# Altium project AMDC.PrjPCB (part 4 of 4)
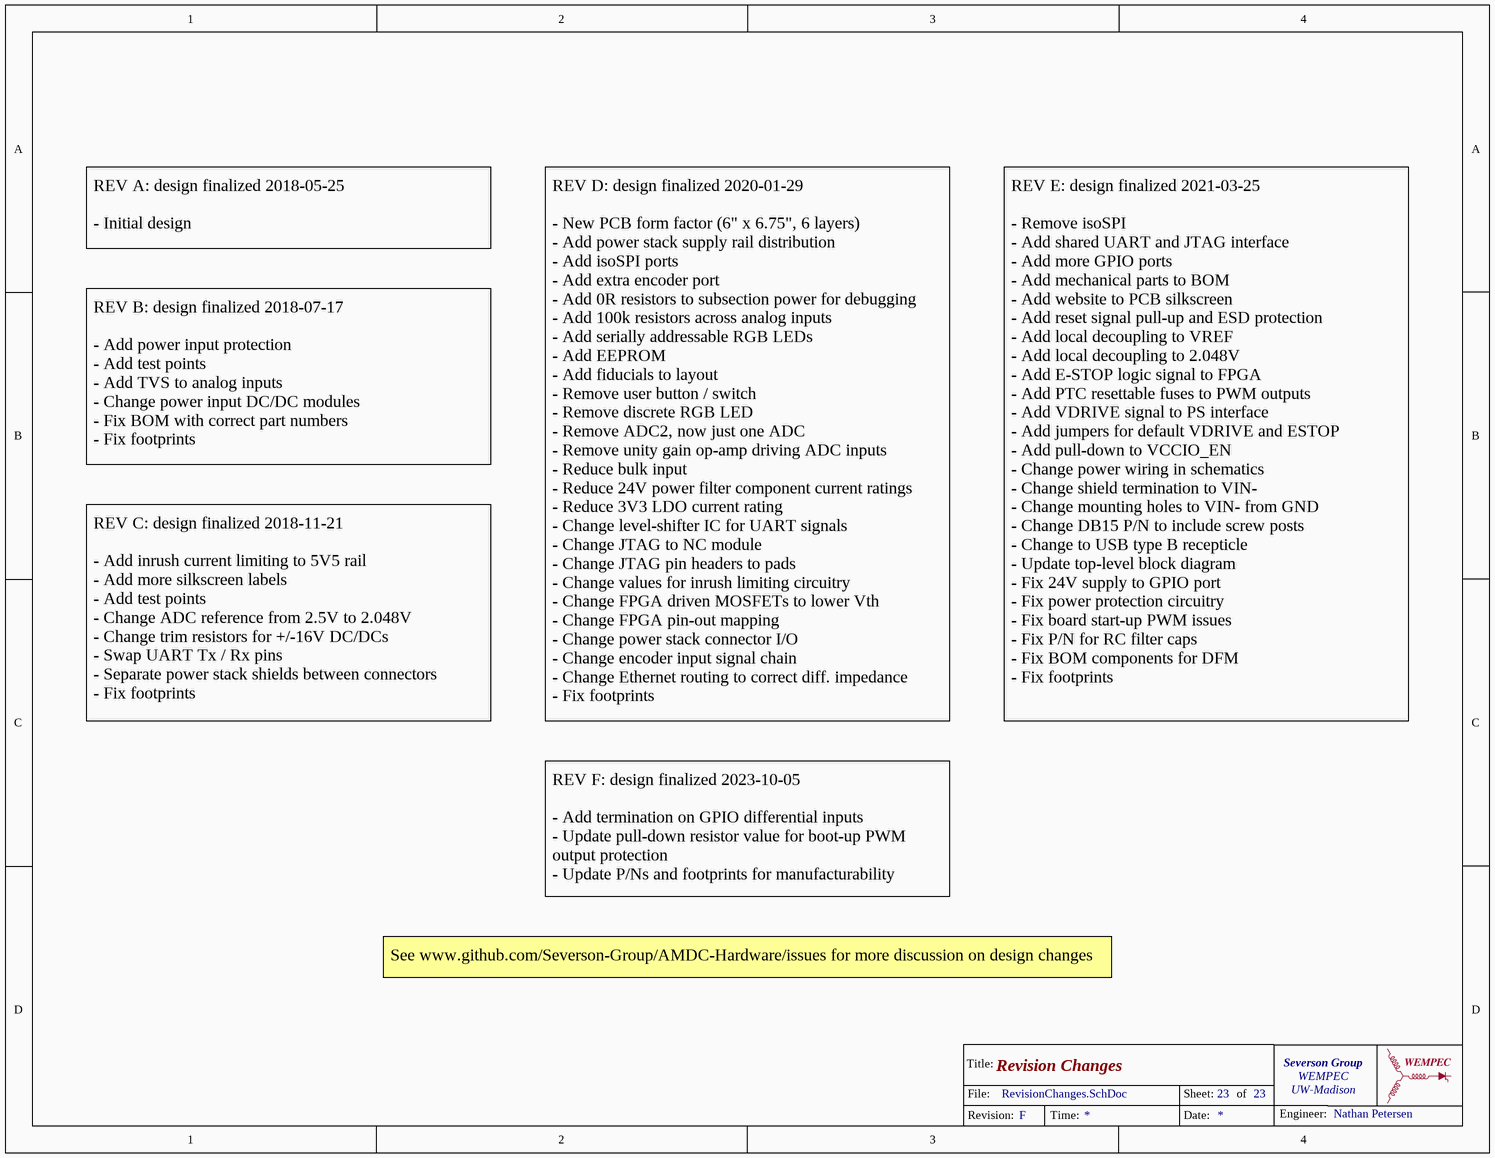
[diagram p23: RevisionChanges.SchDoc]

## Nets that join several sheets
1.8V: PicoZed (5 pins), DriveInterface (C110.2 U42.1 U42.5), InverterTranslation (JP4.3 JP5.3 JP6.3 JP7.3), U_PicoZed/U_DriveInterface/U_InverterTranslation/U_LVHV8ChanTranslation1 (C74A.2 U24A.1 U24A.2), U_PicoZed/U_DriveInterface/U_InverterTranslation/U_LVHV8ChanTranslation2 (C74B.2 U24B.1 U24B.2), U_PicoZed/U_DriveInterface/U_InverterTranslation/U_LVHV8ChanTranslation3 (C74C.2 U24C.1 U24C.2), U_PicoZed/U_DriveInterface/U_InverterTranslation/U_LVHV8ChanTranslation4 (C74D.2 U24D.1 U24D.2), U_PicoZed/U_DriveInterface/U_InverterTranslation/U_LVHV8ChanTranslation5 (C74E.2 U24E.1 U24E.2), U_PicoZed/U_DriveInterface/U_InverterTranslation/U_LVHV8ChanTranslation6 (C74F.2 U24F.1 U24F.2), U_PicoZed/U_DriveInterface/U_InverterTranslation/U_TranslationStsA (C94A.1 U31A.1), U_PicoZed/U_DriveInterface/U_InverterTranslation/U_TranslationStsB (C94B.1 U31B.1), U_PicoZed/U_DriveInterface/U_InverterTranslation/U_TranslationStsC (C94C.1 U31C.1), U_PicoZed/U_DriveInterface/U_InverterTranslation/U_TranslationStsD (C94D.1 U31D.1), AnalogADCs (R81.1), Encoder (C30.1 U5.23 U5.24), BoardIO (6 pins), Power (C43.1 R73.1 U12.1 U12.5), JTAG_UART (C116.2 M1.2 R38.1), U_PicoZed/U_GPIO/U_TranslationGPIO_IN_A (C94E.1 U31E.1), U_PicoZed/U_GPIO/U_TranslationGPIO_OUT_A (C94F.1 U31F.1 U31F.2), U_PicoZed/U_GPIO/U_TranslationGPIO_IN_B (C94G.1 U31G.1), U_PicoZed/U_GPIO/U_TranslationGPIO_OUT_B (C94H.1 U31H.1 U31H.2)
3.3V: DriveInterface (JP1.1), GbEthernet (CON7.14 CON7.16), BoardIO (R2.1 R3.1), Power (R70.1), JTAG_UART (C115.2 M1.8 M1.15)
5.5V: Power (13 pins), Power_InrushLimit (U30.7 U30.8)
5V: DriveInterface (5 pins), U_PicoZed/U_DriveInterface/U_InverterTranslation/U_LVHV8ChanTranslation1 (C71A.1 U24A.23 U24A.24), U_PicoZed/U_DriveInterface/U_InverterTranslation/U_LVHV8ChanTranslation2 (C71B.1 U24B.23 U24B.24), U_PicoZed/U_DriveInterface/U_InverterTranslation/U_LVHV8ChanTranslation3 (C71C.1 U24C.23 U24C.24), U_PicoZed/U_DriveInterface/U_InverterTranslation/U_LVHV8ChanTranslation4 (C71D.1 U24D.23 U24D.24), U_PicoZed/U_DriveInterface/U_InverterTranslation/U_LVHV8ChanTranslation5 (C71E.1 U24E.23 U24E.24), U_PicoZed/U_DriveInterface/U_InverterTranslation/U_LVHV8ChanTranslation6 (C71F.1 U24F.23 U24F.24), AnalogInterface (C98.2 U2.1), AnalogADCs (R80.1), Encoder (9 pins), BoardIO (21 pins), Power (C45.1 R72.1 U12.6), JTAG_UART (U45.5), GPIO (16 pins), U_PicoZed/U_GPIO/U_TranslationGPIO_IN_A (C93E.1 U31E.23 U31E.24), U_PicoZed/U_GPIO/U_TranslationGPIO_OUT_A (C93F.1 U31F.23 U31F.24), U_PicoZed/U_GPIO/U_TranslationGPIO_IN_B (C93G.1 U31G.23 U31G.24), U_PicoZed/U_GPIO/U_TranslationGPIO_OUT_B (C93H.1 U31H.23 U31H.24)
24V: Power (C96.2 C97.2 U7.6), GPIO (CON9.6A CON9.6B CON11.6A CON11.6B)
+15V: AnalogConnectors (CON1.3A CON1.3B CON1.3C CON1.3D), AnalogConditioning (R75.1 R78.1), Power (R71.1)
-15V: AnalogConnectors (CON1.5A CON1.5B CON1.5C CON1.5D), AnalogConditioning (R76.1 R79.1), Power (R74.1)
GND: PicoZed (84 pins), DriveInterface (6 pins), U_PicoZed/U_DriveInterface/U_InverterConnectors/InverterConnector1AB (CON10A.15A CON10A.15B R95A.1 R96A.1), U_PicoZed/U_DriveInterface/U_InverterConnectors/InverterConnector2AB (CON10B.15A CON10B.15B R95B.1 R96B.1), U_PicoZed/U_DriveInterface/U_InverterConnectors/InverterConnector3AB (CON10C.15A CON10C.15B R95C.1 R96C.1), U_PicoZed/U_DriveInterface/U_InverterConnectors/InverterConnector4AB (CON10D.15A CON10D.15B R95D.1 R96D.1), InverterTranslation (JP4.1 JP5.1 JP6.1 JP7.1), U_PicoZed/U_DriveInterface/U_InverterTranslation/U_LVHV8ChanTranslation1 (14 pins), U_PicoZed/U_DriveInterface/U_InverterTranslation/U_LVHV8ChanTranslation2 (14 pins), U_PicoZed/U_DriveInterface/U_InverterTranslation/U_LVHV8ChanTranslation3 (14 pins), U_PicoZed/U_DriveInterface/U_InverterTranslation/U_LVHV8ChanTranslation4 (14 pins), U_PicoZed/U_DriveInterface/U_InverterTranslation/U_LVHV8ChanTranslation5 (14 pins), U_PicoZed/U_DriveInterface/U_InverterTranslation/U_LVHV8ChanTranslation6 (14 pins), U_PicoZed/U_DriveInterface/U_InverterTranslation/U_TranslationStsA (6 pins), U_PicoZed/U_DriveInterface/U_InverterTranslation/U_TranslationStsB (6 pins), U_PicoZed/U_DriveInterface/U_InverterTranslation/U_TranslationStsC (6 pins), U_PicoZed/U_DriveInterface/U_InverterTranslation/U_TranslationStsD (6 pins), AnalogInterface (C98.1 C117.1 U2.3), AnalogADCs (37 pins), AnalogConnectors (24 pins), U_PicoZed/U_AnalogInterface/U_AnalogConditioning/AnalogSigCond_A (10 pins), U_PicoZed/U_AnalogInterface/U_AnalogConditioning/AnalogSigCond_B (10 pins), GbEthernet (C31.1 C32.1 C33.1 C34.1), Encoder (20 pins), BoardIO (25 pins), Power (42 pins), Power_InrushLimit (C91.1 C92.1 U30.5 U30.9), JTAG_UART (8 pins), GPIO (28 pins), U_PicoZed/U_GPIO/U_TranslationGPIO_IN_A (9 pins), U_PicoZed/U_GPIO/U_TranslationGPIO_OUT_A (8 pins), U_PicoZed/U_GPIO/U_TranslationGPIO_IN_B (9 pins), U_PicoZed/U_GPIO/U_TranslationGPIO_OUT_B (8 pins)
GND_IN: U_PicoZed/U_DriveInterface/U_InverterConnectors/InverterConnector1AB (R17A.2), U_PicoZed/U_DriveInterface/U_InverterConnectors/InverterConnector2AB (R17B.2), U_PicoZed/U_DriveInterface/U_InverterConnectors/InverterConnector3AB (R17C.2), U_PicoZed/U_DriveInterface/U_InverterConnectors/InverterConnector4AB (R17D.2), AnalogConnectors (R1.2), GbEthernet (R10.2), Encoder (R9.1), BoardIO (CON3.2), Power (C37.1 L1.2), Power_Protection (6 pins), JTAG_UART (R18.2), GPIO (R19.2 R20.2), BackPage (13 pins)
VCCO: PicoZed (13 pins), Power (R65.2)
VDRIVE: U_PicoZed/U_DriveInterface/U_InverterConnectors/InverterConnector1AB (R93A.2 R94A.2), U_PicoZed/U_DriveInterface/U_InverterConnectors/InverterConnector2AB (R93B.2 R94B.2), U_PicoZed/U_DriveInterface/U_InverterConnectors/InverterConnector3AB (R93C.2 R94C.2), U_PicoZed/U_DriveInterface/U_InverterConnectors/InverterConnector4AB (R93D.2 R94D.2), U_PicoZed/U_DriveInterface/U_InverterTranslation/U_LVHV8ChanTranslation1 (8 pins), U_PicoZed/U_DriveInterface/U_InverterTranslation/U_LVHV8ChanTranslation2 (8 pins), U_PicoZed/U_DriveInterface/U_InverterTranslation/U_LVHV8ChanTranslation3 (8 pins), U_PicoZed/U_DriveInterface/U_InverterTranslation/U_LVHV8ChanTranslation4 (8 pins), U_PicoZed/U_DriveInterface/U_InverterTranslation/U_LVHV8ChanTranslation5 (8 pins), U_PicoZed/U_DriveInterface/U_InverterTranslation/U_LVHV8ChanTranslation6 (8 pins), BoardIO (JP12.2)
VIN_HDR: PicoZed (12 pins), BoardIO (R4.1), Power (R64.1)
5.5VICL: Power (JP10.1), Power_InrushLimit (5 pins)
+15V: AnalogConditioning (R75.2), U_PicoZed/U_AnalogInterface/U_AnalogConditioning/AnalogSigCond_A (C82A.2 C85A.2 U28A.11 U29A.11)
+15V: AnalogConditioning (R78.2), U_PicoZed/U_AnalogInterface/U_AnalogConditioning/AnalogSigCond_B (C82B.2 C85B.2 U28B.11 U29B.11)
-15V: AnalogConditioning (R76.2), U_PicoZed/U_AnalogInterface/U_AnalogConditioning/AnalogSigCond_A (C84A.1 C88A.1 U28A.4 U29A.4)
-15V: AnalogConditioning (R79.2), U_PicoZed/U_AnalogInterface/U_AnalogConditioning/AnalogSigCond_B (C84B.1 C88B.1 U28B.4 U29B.4)
ADC_CLKOUT: PicoZed (SOM1.JX1-23), AnalogADCs (TP3.1 U1.33)
ADC_CNV: PicoZed (SOM1.JX1-9), AnalogADCs (TP1.1 U1.24)
ADC_IN1: AnalogADCs (U1.20), U_PicoZed/U_AnalogInterface/U_AnalogConditioning/AnalogSigCond_A (C79A.1 R63A.1)
ADC_IN2: AnalogADCs (U1.17), U_PicoZed/U_AnalogInterface/U_AnalogConditioning/AnalogSigCond_A (C86A.1 R62A.1)
ADC_IN3: AnalogADCs (U1.14), U_PicoZed/U_AnalogInterface/U_AnalogConditioning/AnalogSigCond_B (C77B.1 R61B.1)
ADC_IN4: AnalogADCs (U1.11), U_PicoZed/U_AnalogInterface/U_AnalogConditioning/AnalogSigCond_B (C81B.1 R60B.1)
ADC_IN5: AnalogADCs (U1.5), U_PicoZed/U_AnalogInterface/U_AnalogConditioning/AnalogSigCond_B (C86B.1 R62B.1)
ADC_IN6: AnalogADCs (U1.2), U_PicoZed/U_AnalogInterface/U_AnalogConditioning/AnalogSigCond_B (C79B.1 R63B.1)
ADC_IN7: AnalogADCs (U1.51), U_PicoZed/U_AnalogInterface/U_AnalogConditioning/AnalogSigCond_A (C81A.1 R60A.1)
ADC_IN8: AnalogADCs (U1.48), U_PicoZed/U_AnalogInterface/U_AnalogConditioning/AnalogSigCond_A (C77A.1 R61A.1)
ADC_SCK: PicoZed (SOM1.JX1-37), AnalogADCs (TP2.1 U1.41)
ADC_SDO1: PicoZed (SOM1.JX1-11), AnalogADCs (U1.27)
ADC_SDO2: PicoZed (SOM1.JX1-13), AnalogADCs (U1.28)
ADC_SDO3: PicoZed (SOM1.JX1-17), AnalogADCs (U1.29)
ADC_SDO4: PicoZed (SOM1.JX1-19), AnalogADCs (U1.30)
ADC_SDO5: PicoZed (SOM1.JX1-25), AnalogADCs (U1.35)
ADC_SDO6: PicoZed (SOM1.JX1-29), AnalogADCs (U1.36)
ADC_SDO7: PicoZed (SOM1.JX1-31), AnalogADCs (U1.39)
ADC_SDO8: PicoZed (SOM1.JX1-35), AnalogADCs (U1.40)
ANLG_N1: AnalogConnectors (CON1.2A R84.1 U37.3), U_PicoZed/U_AnalogInterface/U_AnalogConditioning/AnalogSigCond_A (U29A.10)
ANLG_N2: AnalogConnectors (CON1.8A R85.1 U35.2), U_PicoZed/U_AnalogInterface/U_AnalogConditioning/AnalogSigCond_A (U29A.12)
ANLG_N3: AnalogConnectors (CON1.2B R86.1 U36.1), U_PicoZed/U_AnalogInterface/U_AnalogConditioning/AnalogSigCond_B (U28B.10)
ANLG_N4: AnalogConnectors (CON1.8B R87.1 U38.2), U_PicoZed/U_AnalogInterface/U_AnalogConditioning/AnalogSigCond_B (U28B.12)
ANLG_N5: AnalogConnectors (CON1.2C R88.1 U35.4), U_PicoZed/U_AnalogInterface/U_AnalogConditioning/AnalogSigCond_B (U29B.12)
ANLG_N6: AnalogConnectors (CON1.8C R89.1 U37.2), U_PicoZed/U_AnalogInterface/U_AnalogConditioning/AnalogSigCond_B (U29B.10)
ANLG_N7: AnalogConnectors (CON1.2D R90.1 U38.4), U_PicoZed/U_AnalogInterface/U_AnalogConditioning/AnalogSigCond_A (U28A.12)
ANLG_N8: AnalogConnectors (CON1.8D R91.1 U36.3), U_PicoZed/U_AnalogInterface/U_AnalogConditioning/AnalogSigCond_A (U28A.10)
ANLG_P1: AnalogConnectors (CON1.1A R84.2 U37.4), U_PicoZed/U_AnalogInterface/U_AnalogConditioning/AnalogSigCond_A (U29A.8)
ANLG_P2: AnalogConnectors (CON1.7A R85.2 U35.1), U_PicoZed/U_AnalogInterface/U_AnalogConditioning/AnalogSigCond_A (U29A.14)
ANLG_P3: AnalogConnectors (CON1.1B R86.2 U36.4), U_PicoZed/U_AnalogInterface/U_AnalogConditioning/AnalogSigCond_B (U28B.8)
ANLG_P4: AnalogConnectors (CON1.7B R87.2 U38.1), U_PicoZed/U_AnalogInterface/U_AnalogConditioning/AnalogSigCond_B (U28B.14)
ANLG_P5: AnalogConnectors (CON1.1C R88.2 U35.3), U_PicoZed/U_AnalogInterface/U_AnalogConditioning/AnalogSigCond_B (U29B.14)
ANLG_P6: AnalogConnectors (CON1.7C R89.2 U37.1), U_PicoZed/U_AnalogInterface/U_AnalogConditioning/AnalogSigCond_B (U29B.8)
ANLG_P7: AnalogConnectors (CON1.1D R90.2 U38.3), U_PicoZed/U_AnalogInterface/U_AnalogConditioning/AnalogSigCond_A (U28A.14)
ANLG_P8: AnalogConnectors (CON1.7D R91.2 U36.2), U_PicoZed/U_AnalogInterface/U_AnalogConditioning/AnalogSigCond_A (U28A.8)
CARRIER_SRST_N: PicoZed (SOM1.JX1-6), BoardIO (C24.2 R21.2), JTAG_UART (M1.9 R38.2)
DRIVE_EN: DriveInterface (U43.4), U_PicoZed/U_DriveInterface/U_InverterTranslation/U_LVHV8ChanTranslation1 (8 pins), U_PicoZed/U_DriveInterface/U_InverterTranslation/U_LVHV8ChanTranslation2 (8 pins), U_PicoZed/U_DriveInterface/U_InverterTranslation/U_LVHV8ChanTranslation3 (8 pins), U_PicoZed/U_DriveInterface/U_InverterTranslation/U_LVHV8ChanTranslation4 (8 pins), U_PicoZed/U_DriveInterface/U_InverterTranslation/U_LVHV8ChanTranslation5 (8 pins), U_PicoZed/U_DriveInterface/U_InverterTranslation/U_LVHV8ChanTranslation6 (8 pins)
ESTOP_DRIVE_EN: DriveInterface (U43.2), BoardIO (7 pins)
ETH_MD1_N: PicoZed (SOM1.JX3-53), GbEthernet (CON7.10)
ETH_MD1_P: PicoZed (SOM1.JX3-51), GbEthernet (CON7.11)
ETH_MD2_N: PicoZed (SOM1.JX3-54), GbEthernet (CON7.5)
ETH_MD2_P: PicoZed (SOM1.JX3-52), GbEthernet (CON7.4)
ETH_MD3_N: PicoZed (SOM1.JX3-59), GbEthernet (CON7.2)
ETH_MD3_P: PicoZed (SOM1.JX3-57), GbEthernet (CON7.3)
ETH_MD4_N: PicoZed (SOM1.JX3-60), GbEthernet (CON7.9)
ETH_MD4_P: PicoZed (SOM1.JX3-58), GbEthernet (CON7.8)
ETH_PHY_LED0: PicoZed (SOM1.JX3-47), GbEthernet (CON7.13)
ETH_PHY_LED1: PicoZed (SOM1.JX3-48), GbEthernet (CON7.17)
FPGA_DONE: PicoZed (SOM1.JX1-8), BoardIO (R6.2)
GND_IN_PS: U_PicoZed/U_DriveInterface/U_InverterConnectors/InverterConnector1AB (CON10A.14A CON10A.14B), U_PicoZed/U_DriveInterface/U_InverterConnectors/InverterConnector2AB (CON10B.14A CON10B.14B), U_PicoZed/U_DriveInterface/U_InverterConnectors/InverterConnector3AB (CON10C.14A CON10C.14B), U_PicoZed/U_DriveInterface/U_InverterConnectors/InverterConnector4AB (CON10D.14A CON10D.14B), BoardIO (CON5.2)
GPIO1_IN1: GPIO (U22.3), U_PicoZed/U_GPIO/U_TranslationGPIO_IN_A (U31E.21)
GPIO1_IN2: GPIO (U22.5), U_PicoZed/U_GPIO/U_TranslationGPIO_IN_A (U31E.20)
GPIO1_IN3: GPIO (U22.11), U_PicoZed/U_GPIO/U_TranslationGPIO_IN_A (U31E.19)
GPIO1_OUT1: GPIO (U33.1), U_PicoZed/U_GPIO/U_TranslationGPIO_OUT_A (U31F.21)
GPIO1_OUT2: GPIO (U33.7), U_PicoZed/U_GPIO/U_TranslationGPIO_OUT_A (U31F.20)
GPIO1_OUT3: GPIO (U33.9), U_PicoZed/U_GPIO/U_TranslationGPIO_OUT_A (U31F.19)
GPIO2_IN1: GPIO (U22.13), U_PicoZed/U_GPIO/U_TranslationGPIO_IN_A (U31E.18)
GPIO2_IN2: GPIO (U34.3), U_PicoZed/U_GPIO/U_TranslationGPIO_IN_A (U31E.17)
GPIO2_IN3: GPIO (U34.5), U_PicoZed/U_GPIO/U_TranslationGPIO_IN_A (U31E.16)
GPIO2_OUT1: GPIO (U33.15), U_PicoZed/U_GPIO/U_TranslationGPIO_OUT_A (U31F.18)
GPIO2_OUT2: GPIO (U46.1), U_PicoZed/U_GPIO/U_TranslationGPIO_OUT_A (U31F.17)
GPIO2_OUT3: GPIO (U46.7), U_PicoZed/U_GPIO/U_TranslationGPIO_OUT_A (U31F.16)
GPIO3_IN1: GPIO (U34.11), U_PicoZed/U_GPIO/U_TranslationGPIO_IN_B (U31G.21)
GPIO3_IN2: GPIO (U34.13), U_PicoZed/U_GPIO/U_TranslationGPIO_IN_B (U31G.20)
GPIO3_IN3: GPIO (U47.3), U_PicoZed/U_GPIO/U_TranslationGPIO_IN_B (U31G.19)
GPIO3_OUT1: GPIO (U46.9), U_PicoZed/U_GPIO/U_TranslationGPIO_OUT_B (U31H.21)
GPIO3_OUT2: GPIO (U46.15), U_PicoZed/U_GPIO/U_TranslationGPIO_OUT_B (U31H.20)
GPIO3_OUT3: GPIO (U48.1), U_PicoZed/U_GPIO/U_TranslationGPIO_OUT_B (U31H.19)
GPIO4_IN1: GPIO (U47.5), U_PicoZed/U_GPIO/U_TranslationGPIO_IN_B (U31G.18)
GPIO4_IN2: GPIO (U47.11), U_PicoZed/U_GPIO/U_TranslationGPIO_IN_B (U31G.17)
GPIO4_IN3: GPIO (U47.13), U_PicoZed/U_GPIO/U_TranslationGPIO_IN_B (U31G.16)
GPIO4_OUT1: GPIO (U48.7), U_PicoZed/U_GPIO/U_TranslationGPIO_OUT_B (U31H.18)
GPIO4_OUT2: GPIO (U48.9), U_PicoZed/U_GPIO/U_TranslationGPIO_OUT_B (U31H.17)
GPIO4_OUT3: GPIO (U48.15), U_PicoZed/U_GPIO/U_TranslationGPIO_OUT_B (U31H.16)
INV1_PWM1: U_PicoZed/U_DriveInterface/U_InverterConnectors/InverterConnector1AB (RT1A.1), U_PicoZed/U_DriveInterface/U_InverterTranslation/U_LVHV8ChanTranslation5 (U23E.11)
INV1_PWM2: U_PicoZed/U_DriveInterface/U_InverterConnectors/InverterConnector1AB (RT3A.1), U_PicoZed/U_DriveInterface/U_InverterTranslation/U_LVHV8ChanTranslation5 (U23E.12)
INV1_PWM3: U_PicoZed/U_DriveInterface/U_InverterConnectors/InverterConnector1AB (RT5A.1), U_PicoZed/U_DriveInterface/U_InverterTranslation/U_LVHV8ChanTranslation5 (U23E.13)
INV1_PWM4: U_PicoZed/U_DriveInterface/U_InverterConnectors/InverterConnector1AB (RT7A.1), U_PicoZed/U_DriveInterface/U_InverterTranslation/U_LVHV8ChanTranslation5 (U23E.14)
INV1_PWM5: U_PicoZed/U_DriveInterface/U_InverterConnectors/InverterConnector1AB (RT9A.1), U_PicoZed/U_DriveInterface/U_InverterTranslation/U_LVHV8ChanTranslation6 (U25F.11)
INV1_PWM6: U_PicoZed/U_DriveInterface/U_InverterConnectors/InverterConnector1AB (RT11A.1), U_PicoZed/U_DriveInterface/U_InverterTranslation/U_LVHV8ChanTranslation6 (U25F.12)
INV2_PWM1: U_PicoZed/U_DriveInterface/U_InverterConnectors/InverterConnector1AB (RT2A.1), U_PicoZed/U_DriveInterface/U_InverterTranslation/U_LVHV8ChanTranslation6 (U23F.13)
INV2_PWM2: U_PicoZed/U_DriveInterface/U_InverterConnectors/InverterConnector1AB (RT4A.1), U_PicoZed/U_DriveInterface/U_InverterTranslation/U_LVHV8ChanTranslation6 (U23F.12)
INV2_PWM3: U_PicoZed/U_DriveInterface/U_InverterConnectors/InverterConnector1AB (RT6A.1), U_PicoZed/U_DriveInterface/U_InverterTranslation/U_LVHV8ChanTranslation6 (U23F.11)
INV2_PWM4: U_PicoZed/U_DriveInterface/U_InverterConnectors/InverterConnector1AB (RT8A.1), U_PicoZed/U_DriveInterface/U_InverterTranslation/U_LVHV8ChanTranslation6 (U25F.14)
INV2_PWM5: U_PicoZed/U_DriveInterface/U_InverterConnectors/InverterConnector1AB (RT10A.1), U_PicoZed/U_DriveInterface/U_InverterTranslation/U_LVHV8ChanTranslation6 (U25F.13)
INV2_PWM6: U_PicoZed/U_DriveInterface/U_InverterConnectors/InverterConnector1AB (RT12A.1), U_PicoZed/U_DriveInterface/U_InverterTranslation/U_LVHV8ChanTranslation6 (U23F.14)
INV3_PWM1: U_PicoZed/U_DriveInterface/U_InverterConnectors/InverterConnector2AB (RT1B.1), U_PicoZed/U_DriveInterface/U_InverterTranslation/U_LVHV8ChanTranslation4 (U25D.11)
INV3_PWM2: U_PicoZed/U_DriveInterface/U_InverterConnectors/InverterConnector2AB (RT3B.1), U_PicoZed/U_DriveInterface/U_InverterTranslation/U_LVHV8ChanTranslation4 (U25D.12)
INV3_PWM3: U_PicoZed/U_DriveInterface/U_InverterConnectors/InverterConnector2AB (RT5B.1), U_PicoZed/U_DriveInterface/U_InverterTranslation/U_LVHV8ChanTranslation4 (U25D.13)
INV3_PWM4: U_PicoZed/U_DriveInterface/U_InverterConnectors/InverterConnector2AB (RT7B.1), U_PicoZed/U_DriveInterface/U_InverterTranslation/U_LVHV8ChanTranslation4 (U25D.14)
INV3_PWM5: U_PicoZed/U_DriveInterface/U_InverterConnectors/InverterConnector2AB (RT9B.1), U_PicoZed/U_DriveInterface/U_InverterTranslation/U_LVHV8ChanTranslation4 (U23D.11)
INV3_PWM6: U_PicoZed/U_DriveInterface/U_InverterConnectors/InverterConnector2AB (RT11B.1), U_PicoZed/U_DriveInterface/U_InverterTranslation/U_LVHV8ChanTranslation4 (U23D.12)
INV4_PWM1: U_PicoZed/U_DriveInterface/U_InverterConnectors/InverterConnector2AB (RT2B.1), U_PicoZed/U_DriveInterface/U_InverterTranslation/U_LVHV8ChanTranslation5 (U25E.13)
INV4_PWM2: U_PicoZed/U_DriveInterface/U_InverterConnectors/InverterConnector2AB (RT4B.1), U_PicoZed/U_DriveInterface/U_InverterTranslation/U_LVHV8ChanTranslation5 (U25E.12)
INV4_PWM3: U_PicoZed/U_DriveInterface/U_InverterConnectors/InverterConnector2AB (RT6B.1), U_PicoZed/U_DriveInterface/U_InverterTranslation/U_LVHV8ChanTranslation5 (U25E.11)
INV4_PWM4: U_PicoZed/U_DriveInterface/U_InverterConnectors/InverterConnector2AB (RT8B.1), U_PicoZed/U_DriveInterface/U_InverterTranslation/U_LVHV8ChanTranslation4 (U23D.14)
INV4_PWM5: U_PicoZed/U_DriveInterface/U_InverterConnectors/InverterConnector2AB (RT10B.1), U_PicoZed/U_DriveInterface/U_InverterTranslation/U_LVHV8ChanTranslation4 (U23D.13)
INV4_PWM6: U_PicoZed/U_DriveInterface/U_InverterConnectors/InverterConnector2AB (RT12B.1), U_PicoZed/U_DriveInterface/U_InverterTranslation/U_LVHV8ChanTranslation5 (U25E.14)
INV5_PWM1: U_PicoZed/U_DriveInterface/U_InverterConnectors/InverterConnector3AB (RT1C.1), U_PicoZed/U_DriveInterface/U_InverterTranslation/U_LVHV8ChanTranslation2 (U23B.11)
INV5_PWM2: U_PicoZed/U_DriveInterface/U_InverterConnectors/InverterConnector3AB (RT3C.1), U_PicoZed/U_DriveInterface/U_InverterTranslation/U_LVHV8ChanTranslation2 (U23B.12)
INV5_PWM3: U_PicoZed/U_DriveInterface/U_InverterConnectors/InverterConnector3AB (RT5C.1), U_PicoZed/U_DriveInterface/U_InverterTranslation/U_LVHV8ChanTranslation2 (U23B.13)
INV5_PWM4: U_PicoZed/U_DriveInterface/U_InverterConnectors/InverterConnector3AB (RT7C.1), U_PicoZed/U_DriveInterface/U_InverterTranslation/U_LVHV8ChanTranslation2 (U23B.14)
INV5_PWM5: U_PicoZed/U_DriveInterface/U_InverterConnectors/InverterConnector3AB (RT9C.1), U_PicoZed/U_DriveInterface/U_InverterTranslation/U_LVHV8ChanTranslation3 (U25C.11)
INV5_PWM6: U_PicoZed/U_DriveInterface/U_InverterConnectors/InverterConnector3AB (RT11C.1), U_PicoZed/U_DriveInterface/U_InverterTranslation/U_LVHV8ChanTranslation3 (U25C.12)
INV6_PWM1: U_PicoZed/U_DriveInterface/U_InverterConnectors/InverterConnector3AB (RT2C.1), U_PicoZed/U_DriveInterface/U_InverterTranslation/U_LVHV8ChanTranslation3 (U23C.13)
INV6_PWM2: U_PicoZed/U_DriveInterface/U_InverterConnectors/InverterConnector3AB (RT4C.1), U_PicoZed/U_DriveInterface/U_InverterTranslation/U_LVHV8ChanTranslation3 (U23C.12)
INV6_PWM3: U_PicoZed/U_DriveInterface/U_InverterConnectors/InverterConnector3AB (RT6C.1), U_PicoZed/U_DriveInterface/U_InverterTranslation/U_LVHV8ChanTranslation3 (U23C.11)
INV6_PWM4: U_PicoZed/U_DriveInterface/U_InverterConnectors/InverterConnector3AB (RT8C.1), U_PicoZed/U_DriveInterface/U_InverterTranslation/U_LVHV8ChanTranslation3 (U25C.14)
INV6_PWM5: U_PicoZed/U_DriveInterface/U_InverterConnectors/InverterConnector3AB (RT10C.1), U_PicoZed/U_DriveInterface/U_InverterTranslation/U_LVHV8ChanTranslation3 (U25C.13)
INV6_PWM6: U_PicoZed/U_DriveInterface/U_InverterConnectors/InverterConnector3AB (RT12C.1), U_PicoZed/U_DriveInterface/U_InverterTranslation/U_LVHV8ChanTranslation3 (U23C.14)
INV7_PWM1: U_PicoZed/U_DriveInterface/U_InverterConnectors/InverterConnector4AB (RT1D.1), U_PicoZed/U_DriveInterface/U_InverterTranslation/U_LVHV8ChanTranslation1 (U25A.11)
INV7_PWM2: U_PicoZed/U_DriveInterface/U_InverterConnectors/InverterConnector4AB (RT3D.1), U_PicoZed/U_DriveInterface/U_InverterTranslation/U_LVHV8ChanTranslation1 (U25A.12)
INV7_PWM3: U_PicoZed/U_DriveInterface/U_InverterConnectors/InverterConnector4AB (RT5D.1), U_PicoZed/U_DriveInterface/U_InverterTranslation/U_LVHV8ChanTranslation1 (U25A.13)
INV7_PWM4: U_PicoZed/U_DriveInterface/U_InverterConnectors/InverterConnector4AB (RT7D.1), U_PicoZed/U_DriveInterface/U_InverterTranslation/U_LVHV8ChanTranslation1 (U25A.14)
INV7_PWM5: U_PicoZed/U_DriveInterface/U_InverterConnectors/InverterConnector4AB (RT9D.1), U_PicoZed/U_DriveInterface/U_InverterTranslation/U_LVHV8ChanTranslation1 (U23A.11)
INV7_PWM6: U_PicoZed/U_DriveInterface/U_InverterConnectors/InverterConnector4AB (RT11D.1), U_PicoZed/U_DriveInterface/U_InverterTranslation/U_LVHV8ChanTranslation1 (U23A.12)
INV8_PWM1: U_PicoZed/U_DriveInterface/U_InverterConnectors/InverterConnector4AB (RT2D.1), U_PicoZed/U_DriveInterface/U_InverterTranslation/U_LVHV8ChanTranslation2 (U25B.13)
INV8_PWM2: U_PicoZed/U_DriveInterface/U_InverterConnectors/InverterConnector4AB (RT4D.1), U_PicoZed/U_DriveInterface/U_InverterTranslation/U_LVHV8ChanTranslation2 (U25B.12)
INV8_PWM3: U_PicoZed/U_DriveInterface/U_InverterConnectors/InverterConnector4AB (RT6D.1), U_PicoZed/U_DriveInterface/U_InverterTranslation/U_LVHV8ChanTranslation2 (U25B.11)
INV8_PWM4: U_PicoZed/U_DriveInterface/U_InverterConnectors/InverterConnector4AB (RT8D.1), U_PicoZed/U_DriveInterface/U_InverterTranslation/U_LVHV8ChanTranslation1 (U23A.14)
INV8_PWM5: U_PicoZed/U_DriveInterface/U_InverterConnectors/InverterConnector4AB (RT10D.1), U_PicoZed/U_DriveInterface/U_InverterTranslation/U_LVHV8ChanTranslation1 (U23A.13)
INV8_PWM6: U_PicoZed/U_DriveInterface/U_InverterConnectors/InverterConnector4AB (RT12D.1), U_PicoZed/U_DriveInterface/U_InverterTranslation/U_LVHV8ChanTranslation2 (U25B.14)
INV_STS_A1: U_PicoZed/U_DriveInterface/U_InverterConnectors/InverterConnector1AB (CON10A.8A), U_PicoZed/U_DriveInterface/U_InverterTranslation/U_TranslationStsA (U31A.21)
INV_STS_A2: U_PicoZed/U_DriveInterface/U_InverterConnectors/InverterConnector1AB (CON10A.8B), U_PicoZed/U_DriveInterface/U_InverterTranslation/U_TranslationStsA (U31A.20)
INV_STS_A3: U_PicoZed/U_DriveInterface/U_InverterConnectors/InverterConnector2AB (CON10B.8A), U_PicoZed/U_DriveInterface/U_InverterTranslation/U_TranslationStsA (U31A.19)
INV_STS_A4: U_PicoZed/U_DriveInterface/U_InverterConnectors/InverterConnector2AB (CON10B.8B), U_PicoZed/U_DriveInterface/U_InverterTranslation/U_TranslationStsA (U31A.18)
INV_STS_A5: U_PicoZed/U_DriveInterface/U_InverterConnectors/InverterConnector3AB (CON10C.8A), U_PicoZed/U_DriveInterface/U_InverterTranslation/U_TranslationStsA (U31A.17)
INV_STS_A6: U_PicoZed/U_DriveInterface/U_InverterConnectors/InverterConnector3AB (CON10C.8B), U_PicoZed/U_DriveInterface/U_InverterTranslation/U_TranslationStsA (U31A.16)
INV_STS_A7: U_PicoZed/U_DriveInterface/U_InverterConnectors/InverterConnector4AB (CON10D.8A), U_PicoZed/U_DriveInterface/U_InverterTranslation/U_TranslationStsA (U31A.15)
INV_STS_A8: U_PicoZed/U_DriveInterface/U_InverterConnectors/InverterConnector4AB (CON10D.8B), U_PicoZed/U_DriveInterface/U_InverterTranslation/U_TranslationStsA (U31A.14)
INV_STS_A_DIR: InverterTranslation (JP4.2), U_PicoZed/U_DriveInterface/U_InverterTranslation/U_TranslationStsA (U31A.2)
INV_STS_B1: U_PicoZed/U_DriveInterface/U_InverterConnectors/InverterConnector1AB (CON10A.9A), U_PicoZed/U_DriveInterface/U_InverterTranslation/U_TranslationStsB (U31B.21)
INV_STS_B2: U_PicoZed/U_DriveInterface/U_InverterConnectors/InverterConnector1AB (CON10A.9B), U_PicoZed/U_DriveInterface/U_InverterTranslation/U_TranslationStsB (U31B.20)
INV_STS_B3: U_PicoZed/U_DriveInterface/U_InverterConnectors/InverterConnector2AB (CON10B.9A), U_PicoZed/U_DriveInterface/U_InverterTranslation/U_TranslationStsB (U31B.19)
INV_STS_B4: U_PicoZed/U_DriveInterface/U_InverterConnectors/InverterConnector2AB (CON10B.9B), U_PicoZed/U_DriveInterface/U_InverterTranslation/U_TranslationStsB (U31B.18)
INV_STS_B5: U_PicoZed/U_DriveInterface/U_InverterConnectors/InverterConnector3AB (CON10C.9A), U_PicoZed/U_DriveInterface/U_InverterTranslation/U_TranslationStsB (U31B.17)
INV_STS_B6: U_PicoZed/U_DriveInterface/U_InverterConnectors/InverterConnector3AB (CON10C.9B), U_PicoZed/U_DriveInterface/U_InverterTranslation/U_TranslationStsB (U31B.16)
INV_STS_B7: U_PicoZed/U_DriveInterface/U_InverterConnectors/InverterConnector4AB (CON10D.9A), U_PicoZed/U_DriveInterface/U_InverterTranslation/U_TranslationStsB (U31B.15)
INV_STS_B8: U_PicoZed/U_DriveInterface/U_InverterConnectors/InverterConnector4AB (CON10D.9B), U_PicoZed/U_DriveInterface/U_InverterTranslation/U_TranslationStsB (U31B.14)
INV_STS_B_DIR: InverterTranslation (JP5.2), U_PicoZed/U_DriveInterface/U_InverterTranslation/U_TranslationStsB (U31B.2)
INV_STS_C1: U_PicoZed/U_DriveInterface/U_InverterConnectors/InverterConnector1AB (CON10A.10A), U_PicoZed/U_DriveInterface/U_InverterTranslation/U_TranslationStsC (U31C.21)
INV_STS_C2: U_PicoZed/U_DriveInterface/U_InverterConnectors/InverterConnector1AB (CON10A.10B), U_PicoZed/U_DriveInterface/U_InverterTranslation/U_TranslationStsC (U31C.20)
INV_STS_C3: U_PicoZed/U_DriveInterface/U_InverterConnectors/InverterConnector2AB (CON10B.10A), U_PicoZed/U_DriveInterface/U_InverterTranslation/U_TranslationStsC (U31C.19)
INV_STS_C4: U_PicoZed/U_DriveInterface/U_InverterConnectors/InverterConnector2AB (CON10B.10B), U_PicoZed/U_DriveInterface/U_InverterTranslation/U_TranslationStsC (U31C.18)
INV_STS_C5: U_PicoZed/U_DriveInterface/U_InverterConnectors/InverterConnector3AB (CON10C.10A), U_PicoZed/U_DriveInterface/U_InverterTranslation/U_TranslationStsC (U31C.17)
INV_STS_C6: U_PicoZed/U_DriveInterface/U_InverterConnectors/InverterConnector3AB (CON10C.10B), U_PicoZed/U_DriveInterface/U_InverterTranslation/U_TranslationStsC (U31C.16)
INV_STS_C7: U_PicoZed/U_DriveInterface/U_InverterConnectors/InverterConnector4AB (CON10D.10A), U_PicoZed/U_DriveInterface/U_InverterTranslation/U_TranslationStsC (U31C.15)
INV_STS_C8: U_PicoZed/U_DriveInterface/U_InverterConnectors/InverterConnector4AB (CON10D.10B), U_PicoZed/U_DriveInterface/U_InverterTranslation/U_TranslationStsC (U31C.14)
INV_STS_C_DIR: InverterTranslation (JP6.2), U_PicoZed/U_DriveInterface/U_InverterTranslation/U_TranslationStsC (U31C.2)
INV_STS_D1: U_PicoZed/U_DriveInterface/U_InverterConnectors/InverterConnector1AB (CON10A.11A), U_PicoZed/U_DriveInterface/U_InverterTranslation/U_TranslationStsD (U31D.21)
INV_STS_D2: U_PicoZed/U_DriveInterface/U_InverterConnectors/InverterConnector1AB (CON10A.11B), U_PicoZed/U_DriveInterface/U_InverterTranslation/U_TranslationStsD (U31D.20)
INV_STS_D3: U_PicoZed/U_DriveInterface/U_InverterConnectors/InverterConnector2AB (CON10B.11A), U_PicoZed/U_DriveInterface/U_InverterTranslation/U_TranslationStsD (U31D.19)
INV_STS_D4: U_PicoZed/U_DriveInterface/U_InverterConnectors/InverterConnector2AB (CON10B.11B), U_PicoZed/U_DriveInterface/U_InverterTranslation/U_TranslationStsD (U31D.18)
INV_STS_D5: U_PicoZed/U_DriveInterface/U_InverterConnectors/InverterConnector3AB (CON10C.11A), U_PicoZed/U_DriveInterface/U_InverterTranslation/U_TranslationStsD (U31D.17)
INV_STS_D6: U_PicoZed/U_DriveInterface/U_InverterConnectors/InverterConnector3AB (CON10C.11B), U_PicoZed/U_DriveInterface/U_InverterTranslation/U_TranslationStsD (U31D.16)
INV_STS_D7: U_PicoZed/U_DriveInterface/U_InverterConnectors/InverterConnector4AB (CON10D.11A), U_PicoZed/U_DriveInterface/U_InverterTranslation/U_TranslationStsD (U31D.15)
INV_STS_D8: U_PicoZed/U_DriveInterface/U_InverterConnectors/InverterConnector4AB (CON10D.11B), U_PicoZed/U_DriveInterface/U_InverterTranslation/U_TranslationStsD (U31D.14)
INV_STS_D_DIR: InverterTranslation (JP7.2), U_PicoZed/U_DriveInterface/U_InverterTranslation/U_TranslationStsD (U31D.2)
JTAG_TCK: PicoZed (SOM1.JX1-1), JTAG_UART (M1.10 TP8.1)
JTAG_TDI: PicoZed (SOM1.JX1-4), JTAG_UART (M1.12 TP6.1)
JTAG_TDO: PicoZed (SOM1.JX1-3), JTAG_UART (M1.11 TP7.1)
JTAG_TMS: PicoZed (SOM1.JX1-2), JTAG_UART (M1.13 TP5.1)
LV_ENC_1A: PicoZed (SOM1.JX1-54), Encoder (U5.21)
LV_ENC_1B: PicoZed (SOM1.JX1-56), Encoder (U5.20)
LV_ENC_1Z: PicoZed (SOM1.JX1-62), Encoder (U5.19)
LV_ENC_2A: PicoZed (SOM1.JX1-64), Encoder (U5.18)
LV_ENC_2B: PicoZed (SOM1.JX1-68), Encoder (U5.17)
LV_ENC_2Z: PicoZed (SOM1.JX1-70), Encoder (U5.16)
LV_ESTOP_DRIVE_EN: PicoZed (SOM1.JX3-44), BoardIO (U44.4)
LV_GPIO1_IN1: PicoZed (SOM1.JX1-53), U_PicoZed/U_GPIO/U_TranslationGPIO_IN_A (U31E.3)
LV_GPIO1_IN2: PicoZed (SOM1.JX1-55), U_PicoZed/U_GPIO/U_TranslationGPIO_IN_A (U31E.4)
LV_GPIO1_IN3: PicoZed (SOM1.JX1-61), U_PicoZed/U_GPIO/U_TranslationGPIO_IN_A (U31E.5)
LV_GPIO1_OUT1: PicoZed (SOM1.JX1-74), U_PicoZed/U_GPIO/U_TranslationGPIO_OUT_A (U31F.3)
LV_GPIO1_OUT2: PicoZed (SOM1.JX1-76), U_PicoZed/U_GPIO/U_TranslationGPIO_OUT_A (U31F.4)
LV_GPIO1_OUT3: PicoZed (SOM1.JX1-82), U_PicoZed/U_GPIO/U_TranslationGPIO_OUT_A (U31F.5)
LV_GPIO2_IN1: PicoZed (SOM1.JX1-63), U_PicoZed/U_GPIO/U_TranslationGPIO_IN_A (U31E.6)
LV_GPIO2_IN2: PicoZed (SOM1.JX1-67), U_PicoZed/U_GPIO/U_TranslationGPIO_IN_A (U31E.7)
LV_GPIO2_IN3: PicoZed (SOM1.JX1-69), U_PicoZed/U_GPIO/U_TranslationGPIO_IN_A (U31E.8)
LV_GPIO2_OUT1: PicoZed (SOM1.JX1-84), U_PicoZed/U_GPIO/U_TranslationGPIO_OUT_A (U31F.6)
LV_GPIO2_OUT2: PicoZed (SOM1.JX1-88), U_PicoZed/U_GPIO/U_TranslationGPIO_OUT_A (U31F.7)
LV_GPIO2_OUT3: PicoZed (SOM1.JX1-90), U_PicoZed/U_GPIO/U_TranslationGPIO_OUT_A (U31F.8)
LV_GPIO3_IN1: PicoZed (SOM1.JX1-73), U_PicoZed/U_GPIO/U_TranslationGPIO_IN_B (U31G.3)
LV_GPIO3_IN2: PicoZed (SOM1.JX1-75), U_PicoZed/U_GPIO/U_TranslationGPIO_IN_B (U31G.4)
LV_GPIO3_IN3: PicoZed (SOM1.JX1-81), U_PicoZed/U_GPIO/U_TranslationGPIO_IN_B (U31G.5)
LV_GPIO3_OUT1: PicoZed (SOM1.JX1-92), U_PicoZed/U_GPIO/U_TranslationGPIO_OUT_B (U31H.3)
LV_GPIO3_OUT2: PicoZed (SOM1.JX1-94), U_PicoZed/U_GPIO/U_TranslationGPIO_OUT_B (U31H.4)
LV_GPIO3_OUT3: PicoZed (SOM1.JX1-41), U_PicoZed/U_GPIO/U_TranslationGPIO_OUT_B (U31H.5)
LV_GPIO4_IN1: PicoZed (SOM1.JX1-83), U_PicoZed/U_GPIO/U_TranslationGPIO_IN_B (U31G.6)
LV_GPIO4_IN2: PicoZed (SOM1.JX1-87), U_PicoZed/U_GPIO/U_TranslationGPIO_IN_B (U31G.7)
LV_GPIO4_IN3: PicoZed (SOM1.JX1-89), U_PicoZed/U_GPIO/U_TranslationGPIO_IN_B (U31G.8)
LV_GPIO4_OUT1: PicoZed (SOM1.JX1-43), U_PicoZed/U_GPIO/U_TranslationGPIO_OUT_B (U31H.6)
LV_GPIO4_OUT2: PicoZed (SOM1.JX1-47), U_PicoZed/U_GPIO/U_TranslationGPIO_OUT_B (U31H.7)
LV_GPIO4_OUT3: PicoZed (SOM1.JX1-49), U_PicoZed/U_GPIO/U_TranslationGPIO_OUT_B (U31H.8)
LV_INV1_PWM1: PicoZed (SOM1.JX2-20), U_PicoZed/U_DriveInterface/U_InverterTranslation/U_LVHV8ChanTranslation5 (U24E.6)
LV_INV1_PWM2: PicoZed (SOM1.JX2-18), U_PicoZed/U_DriveInterface/U_InverterTranslation/U_LVHV8ChanTranslation5 (U24E.5)
LV_INV1_PWM3: PicoZed (SOM1.JX2-43), U_PicoZed/U_DriveInterface/U_InverterTranslation/U_LVHV8ChanTranslation5 (U24E.4)
LV_INV1_PWM4: PicoZed (SOM1.JX2-41), U_PicoZed/U_DriveInterface/U_InverterTranslation/U_LVHV8ChanTranslation5 (U24E.3)
LV_INV1_PWM5: PicoZed (SOM1.JX2-13), U_PicoZed/U_DriveInterface/U_InverterTranslation/U_LVHV8ChanTranslation6 (U24F.10)
LV_INV1_PWM6: PicoZed (SOM1.JX2-17), U_PicoZed/U_DriveInterface/U_InverterTranslation/U_LVHV8ChanTranslation6 (U24F.9)
LV_INV2_PWM1: PicoZed (SOM1.JX2-31), U_PicoZed/U_DriveInterface/U_InverterTranslation/U_LVHV8ChanTranslation6 (U24F.4)
LV_INV2_PWM2: PicoZed (SOM1.JX2-29), U_PicoZed/U_DriveInterface/U_InverterTranslation/U_LVHV8ChanTranslation6 (U24F.5)
LV_INV2_PWM3: PicoZed (SOM1.JX2-25), U_PicoZed/U_DriveInterface/U_InverterTranslation/U_LVHV8ChanTranslation6 (U24F.6)
LV_INV2_PWM4: PicoZed (SOM1.JX2-23), U_PicoZed/U_DriveInterface/U_InverterTranslation/U_LVHV8ChanTranslation6 (U24F.7)
LV_INV2_PWM5: PicoZed (SOM1.JX2-19), U_PicoZed/U_DriveInterface/U_InverterTranslation/U_LVHV8ChanTranslation6 (U24F.8)
LV_INV2_PWM6: PicoZed (SOM1.JX2-35), U_PicoZed/U_DriveInterface/U_InverterTranslation/U_LVHV8ChanTranslation6 (U24F.3)
LV_INV3_PWM1: PicoZed (SOM1.JX2-56), U_PicoZed/U_DriveInterface/U_InverterTranslation/U_LVHV8ChanTranslation4 (U24D.10)
LV_INV3_PWM2: PicoZed (SOM1.JX2-54), U_PicoZed/U_DriveInterface/U_InverterTranslation/U_LVHV8ChanTranslation4 (U24D.9)
LV_INV3_PWM3: PicoZed (SOM1.JX2-50), U_PicoZed/U_DriveInterface/U_InverterTranslation/U_LVHV8ChanTranslation4 (U24D.8)
LV_INV3_PWM4: PicoZed (SOM1.JX2-48), U_PicoZed/U_DriveInterface/U_InverterTranslation/U_LVHV8ChanTranslation4 (U24D.7)
LV_INV3_PWM5: PicoZed (SOM1.JX2-44), U_PicoZed/U_DriveInterface/U_InverterTranslation/U_LVHV8ChanTranslation4 (U24D.6)
LV_INV3_PWM6: PicoZed (SOM1.JX2-42), U_PicoZed/U_DriveInterface/U_InverterTranslation/U_LVHV8ChanTranslation4 (U24D.5)
LV_INV4_PWM1: PicoZed (SOM1.JX2-26), U_PicoZed/U_DriveInterface/U_InverterTranslation/U_LVHV8ChanTranslation5 (U24E.8)
LV_INV4_PWM2: PicoZed (SOM1.JX2-30), U_PicoZed/U_DriveInterface/U_InverterTranslation/U_LVHV8ChanTranslation5 (U24E.9)
LV_INV4_PWM3: PicoZed (SOM1.JX2-32), U_PicoZed/U_DriveInterface/U_InverterTranslation/U_LVHV8ChanTranslation5 (U24E.10)
LV_INV4_PWM4: PicoZed (SOM1.JX2-36), U_PicoZed/U_DriveInterface/U_InverterTranslation/U_LVHV8ChanTranslation4 (U24D.3)
LV_INV4_PWM5: PicoZed (SOM1.JX2-38), U_PicoZed/U_DriveInterface/U_InverterTranslation/U_LVHV8ChanTranslation4 (U24D.4)
LV_INV4_PWM6: PicoZed (SOM1.JX2-24), U_PicoZed/U_DriveInterface/U_InverterTranslation/U_LVHV8ChanTranslation5 (U24E.7)
LV_INV5_PWM1: PicoZed (SOM1.JX2-88), U_PicoZed/U_DriveInterface/U_InverterTranslation/U_LVHV8ChanTranslation2 (U24B.6)
LV_INV5_PWM2: PicoZed (SOM1.JX2-90), U_PicoZed/U_DriveInterface/U_InverterTranslation/U_LVHV8ChanTranslation2 (U24B.5)
LV_INV5_PWM3: PicoZed (SOM1.JX2-82), U_PicoZed/U_DriveInterface/U_InverterTranslation/U_LVHV8ChanTranslation2 (U24B.4)
LV_INV5_PWM4: PicoZed (SOM1.JX2-84), U_PicoZed/U_DriveInterface/U_InverterTranslation/U_LVHV8ChanTranslation2 (U24B.3)
LV_INV5_PWM5: PicoZed (SOM1.JX2-69), U_PicoZed/U_DriveInterface/U_InverterTranslation/U_LVHV8ChanTranslation3 (U24C.10)
LV_INV5_PWM6: PicoZed (SOM1.JX2-67), U_PicoZed/U_DriveInterface/U_InverterTranslation/U_LVHV8ChanTranslation3 (U24C.9)
LV_INV6_PWM1: PicoZed (SOM1.JX2-64), U_PicoZed/U_DriveInterface/U_InverterTranslation/U_LVHV8ChanTranslation3 (U24C.4)
LV_INV6_PWM2: PicoZed (SOM1.JX2-68), U_PicoZed/U_DriveInterface/U_InverterTranslation/U_LVHV8ChanTranslation3 (U24C.5)
LV_INV6_PWM3: PicoZed (SOM1.JX2-70), U_PicoZed/U_DriveInterface/U_InverterTranslation/U_LVHV8ChanTranslation3 (U24C.6)
LV_INV6_PWM4: PicoZed (SOM1.JX2-74), U_PicoZed/U_DriveInterface/U_InverterTranslation/U_LVHV8ChanTranslation3 (U24C.7)
LV_INV6_PWM5: PicoZed (SOM1.JX2-76), U_PicoZed/U_DriveInterface/U_InverterTranslation/U_LVHV8ChanTranslation3 (U24C.8)
LV_INV6_PWM6: PicoZed (SOM1.JX2-62), U_PicoZed/U_DriveInterface/U_InverterTranslation/U_LVHV8ChanTranslation3 (U24C.3)
LV_INV7_PWM1: PicoZed (SOM1.JX2-81), U_PicoZed/U_DriveInterface/U_InverterTranslation/U_LVHV8ChanTranslation1 (U24A.10)
LV_INV7_PWM2: PicoZed (SOM1.JX2-83), U_PicoZed/U_DriveInterface/U_InverterTranslation/U_LVHV8ChanTranslation1 (U24A.9)
LV_INV7_PWM3: PicoZed (SOM1.JX2-87), U_PicoZed/U_DriveInterface/U_InverterTranslation/U_LVHV8ChanTranslation1 (U24A.8)
LV_INV7_PWM4: PicoZed (SOM1.JX2-89), U_PicoZed/U_DriveInterface/U_InverterTranslation/U_LVHV8ChanTranslation1 (U24A.7)
LV_INV7_PWM5: PicoZed (SOM1.JX2-93), U_PicoZed/U_DriveInterface/U_InverterTranslation/U_LVHV8ChanTranslation1 (U24A.6)
LV_INV7_PWM6: PicoZed (SOM1.JX2-95), U_PicoZed/U_DriveInterface/U_InverterTranslation/U_LVHV8ChanTranslation1 (U24A.5)
LV_INV8_PWM1: PicoZed (SOM1.JX2-94), U_PicoZed/U_DriveInterface/U_InverterTranslation/U_LVHV8ChanTranslation2 (U24B.8)
LV_INV8_PWM2: PicoZed (SOM1.JX2-100), U_PicoZed/U_DriveInterface/U_InverterTranslation/U_LVHV8ChanTranslation2 (U24B.9)
LV_INV8_PWM3: PicoZed (SOM1.JX2-75), U_PicoZed/U_DriveInterface/U_InverterTranslation/U_LVHV8ChanTranslation2 (U24B.10)
LV_INV8_PWM4: PicoZed (SOM1.JX2-99), U_PicoZed/U_DriveInterface/U_InverterTranslation/U_LVHV8ChanTranslation1 (U24A.3)
LV_INV8_PWM5: PicoZed (SOM1.JX2-97), U_PicoZed/U_DriveInterface/U_InverterTranslation/U_LVHV8ChanTranslation1 (U24A.4)
LV_INV8_PWM6: PicoZed (SOM1.JX2-96), U_PicoZed/U_DriveInterface/U_InverterTranslation/U_LVHV8ChanTranslation2 (U24B.7)
LV_INV_STS_A1: PicoZed (SOM1.JX1-30), U_PicoZed/U_DriveInterface/U_InverterTranslation/U_TranslationStsA (U31A.3)
LV_INV_STS_A2: PicoZed (SOM1.JX1-26), U_PicoZed/U_DriveInterface/U_InverterTranslation/U_TranslationStsA (U31A.4)
LV_INV_STS_A3: PicoZed (SOM1.JX1-24), U_PicoZed/U_DriveInterface/U_InverterTranslation/U_TranslationStsA (U31A.5)
LV_INV_STS_A4: PicoZed (SOM1.JX1-20), U_PicoZed/U_DriveInterface/U_InverterTranslation/U_TranslationStsA (U31A.6)
LV_INV_STS_A5: PicoZed (SOM1.JX1-18), U_PicoZed/U_DriveInterface/U_InverterTranslation/U_TranslationStsA (U31A.7)
LV_INV_STS_A6: PicoZed (SOM1.JX1-14), U_PicoZed/U_DriveInterface/U_InverterTranslation/U_TranslationStsA (U31A.8)
LV_INV_STS_A7: PicoZed (SOM1.JX1-12), U_PicoZed/U_DriveInterface/U_InverterTranslation/U_TranslationStsA (U31A.9)
LV_INV_STS_A8: PicoZed (SOM1.JX1-10), U_PicoZed/U_DriveInterface/U_InverterTranslation/U_TranslationStsA (U31A.10)
LV_INV_STS_B1: PicoZed (SOM1.JX3-99), U_PicoZed/U_DriveInterface/U_InverterTranslation/U_TranslationStsB (U31B.3)
LV_INV_STS_B2: PicoZed (SOM1.JX1-50), U_PicoZed/U_DriveInterface/U_InverterTranslation/U_TranslationStsB (U31B.4)
LV_INV_STS_B3: PicoZed (SOM1.JX1-48), U_PicoZed/U_DriveInterface/U_InverterTranslation/U_TranslationStsB (U31B.5)
LV_INV_STS_B4: PicoZed (SOM1.JX1-44), U_PicoZed/U_DriveInterface/U_InverterTranslation/U_TranslationStsB (U31B.6)
LV_INV_STS_B5: PicoZed (SOM1.JX1-42), U_PicoZed/U_DriveInterface/U_InverterTranslation/U_TranslationStsB (U31B.7)
LV_INV_STS_B6: PicoZed (SOM1.JX1-38), U_PicoZed/U_DriveInterface/U_InverterTranslation/U_TranslationStsB (U31B.8)
LV_INV_STS_B7: PicoZed (SOM1.JX1-36), U_PicoZed/U_DriveInterface/U_InverterTranslation/U_TranslationStsB (U31B.9)
LV_INV_STS_B8: PicoZed (SOM1.JX1-32), U_PicoZed/U_DriveInterface/U_InverterTranslation/U_TranslationStsB (U31B.10)
LV_INV_STS_C1: PicoZed (SOM1.JX3-75), U_PicoZed/U_DriveInterface/U_InverterTranslation/U_TranslationStsC (U31C.3)
LV_INV_STS_C2: PicoZed (SOM1.JX3-79), U_PicoZed/U_DriveInterface/U_InverterTranslation/U_TranslationStsC (U31C.4)
LV_INV_STS_C3: PicoZed (SOM1.JX3-81), U_PicoZed/U_DriveInterface/U_InverterTranslation/U_TranslationStsC (U31C.5)
LV_INV_STS_C4: PicoZed (SOM1.JX3-85), U_PicoZed/U_DriveInterface/U_InverterTranslation/U_TranslationStsC (U31C.6)
LV_INV_STS_C5: PicoZed (SOM1.JX3-87), U_PicoZed/U_DriveInterface/U_InverterTranslation/U_TranslationStsC (U31C.7)
LV_INV_STS_C6: PicoZed (SOM1.JX3-91), U_PicoZed/U_DriveInterface/U_InverterTranslation/U_TranslationStsC (U31C.8)
LV_INV_STS_C7: PicoZed (SOM1.JX3-93), U_PicoZed/U_DriveInterface/U_InverterTranslation/U_TranslationStsC (U31C.9)
LV_INV_STS_C8: PicoZed (SOM1.JX3-97), U_PicoZed/U_DriveInterface/U_InverterTranslation/U_TranslationStsC (U31C.10)
LV_INV_STS_D1: PicoZed (SOM1.JX3-80), U_PicoZed/U_DriveInterface/U_InverterTranslation/U_TranslationStsD (U31D.3)
LV_INV_STS_D2: PicoZed (SOM1.JX3-82), U_PicoZed/U_DriveInterface/U_InverterTranslation/U_TranslationStsD (U31D.4)
LV_INV_STS_D3: PicoZed (SOM1.JX3-86), U_PicoZed/U_DriveInterface/U_InverterTranslation/U_TranslationStsD (U31D.5)
LV_INV_STS_D4: PicoZed (SOM1.JX3-88), U_PicoZed/U_DriveInterface/U_InverterTranslation/U_TranslationStsD (U31D.6)
LV_INV_STS_D5: PicoZed (SOM1.JX3-92), U_PicoZed/U_DriveInterface/U_InverterTranslation/U_TranslationStsD (U31D.7)
LV_INV_STS_D6: PicoZed (SOM1.JX3-94), U_PicoZed/U_DriveInterface/U_InverterTranslation/U_TranslationStsD (U31D.8)
LV_INV_STS_D7: PicoZed (SOM1.JX3-98), U_PicoZed/U_DriveInterface/U_InverterTranslation/U_TranslationStsD (U31D.9)
LV_INV_STS_D8: PicoZed (SOM1.JX3-100), U_PicoZed/U_DriveInterface/U_InverterTranslation/U_TranslationStsD (U31D.10)
LV_PS_DRIVE_EN: PicoZed (SOM1.JX3-39), DriveInterface (R48.1 U42.3)
LV_USER_LED_DIN: PicoZed (SOM1.JX2-14), BoardIO (U3.3)
LV_VCCIO_EN: PicoZed (SOM1.JX2-10), Power (R92.1 U12.3)
NetC37_2: Power (C37.2 L1.1), Power_Protection (C80.1 Q3.5 Q3.6 U26.7)
NetC117_2: AnalogInterface (C117.2 R82.1 U2.2), AnalogConditioning (R57.1 R77.1)
NetCON10A_12A: InverterConnectors (R22.1), U_PicoZed/U_DriveInterface/U_InverterConnectors/InverterConnector1AB (CON10A.12A)
NetCON10A_12B: InverterConnectors (R24.1), U_PicoZed/U_DriveInterface/U_InverterConnectors/InverterConnector1AB (CON10A.12B)
NetCON10A_13A: InverterConnectors (R23.1), U_PicoZed/U_DriveInterface/U_InverterConnectors/InverterConnector1AB (CON10A.13A)
NetCON10A_13B: InverterConnectors (R25.1), U_PicoZed/U_DriveInterface/U_InverterConnectors/InverterConnector1AB (CON10A.13B)
NetCON10B_12A: InverterConnectors (R26.1), U_PicoZed/U_DriveInterface/U_InverterConnectors/InverterConnector2AB (CON10B.12A)
NetCON10B_12B: InverterConnectors (R28.1), U_PicoZed/U_DriveInterface/U_InverterConnectors/InverterConnector2AB (CON10B.12B)
NetCON10B_13A: InverterConnectors (R27.1), U_PicoZed/U_DriveInterface/U_InverterConnectors/InverterConnector2AB (CON10B.13A)
NetCON10B_13B: InverterConnectors (R29.1), U_PicoZed/U_DriveInterface/U_InverterConnectors/InverterConnector2AB (CON10B.13B)
NetCON10C_12A: InverterConnectors (R30.1), U_PicoZed/U_DriveInterface/U_InverterConnectors/InverterConnector3AB (CON10C.12A)
NetCON10C_12B: InverterConnectors (R32.1), U_PicoZed/U_DriveInterface/U_InverterConnectors/InverterConnector3AB (CON10C.12B)
NetCON10C_13A: InverterConnectors (R31.1), U_PicoZed/U_DriveInterface/U_InverterConnectors/InverterConnector3AB (CON10C.13A)
NetCON10C_13B: InverterConnectors (R33.1), U_PicoZed/U_DriveInterface/U_InverterConnectors/InverterConnector3AB (CON10C.13B)
NetCON10D_12A: InverterConnectors (R34.1), U_PicoZed/U_DriveInterface/U_InverterConnectors/InverterConnector4AB (CON10D.12A)
NetCON10D_12B: InverterConnectors (R36.1), U_PicoZed/U_DriveInterface/U_InverterConnectors/InverterConnector4AB (CON10D.12B)
NetCON10D_13A: InverterConnectors (R35.1), U_PicoZed/U_DriveInterface/U_InverterConnectors/InverterConnector4AB (CON10D.13A)
NetCON10D_13B: InverterConnectors (R37.1), U_PicoZed/U_DriveInterface/U_InverterConnectors/InverterConnector4AB (CON10D.13B)
USB_UART_RXD: PicoZed (SOM1.JX3-64), JTAG_UART (M1.5 TP10.1)
USB_UART_TXD: PicoZed (SOM1.JX3-66), JTAG_UART (M1.6 TP9.1)
VDDPS: DriveInterface (JP1.2), InverterConnectors (8 pins), U_PicoZed/U_DriveInterface/U_InverterTranslation/U_TranslationStsA (C93A.1 U31A.23 U31A.24), U_PicoZed/U_DriveInterface/U_InverterTranslation/U_TranslationStsB (C93B.1 U31B.23 U31B.24), U_PicoZed/U_DriveInterface/U_InverterTranslation/U_TranslationStsC (C93C.1 U31C.23 U31C.24), U_PicoZed/U_DriveInterface/U_InverterTranslation/U_TranslationStsD (C93D.1 U31D.23 U31D.24)
VIN: BoardIO (CON3.1), Power_Protection (7 pins)
VIN_PS: InverterConnectors (8 pins), BoardIO (CON5.1)
VREF: AnalogInterface (R82.2), AnalogADCs (16 pins)
VREF: AnalogConditioning (R77.2), U_PicoZed/U_AnalogInterface/U_AnalogConditioning/AnalogSigCond_A (6 pins)
VREF: AnalogConditioning (R57.2), U_PicoZed/U_AnalogInterface/U_AnalogConditioning/AnalogSigCond_B (6 pins)